# Altium schematic sheet Seven-Seg Displays.SchDoc
size A4; Organization: Machine Intellgence Laboratory; Des1: This board uses a 4-digit; Des2: seven-segment display to show; Des3: battery voltage & current draw.; SheetNumber: 3; SheetTotal: 4; Author1: Russell MacGregor; VersionControl_Repository: BatteryMonitorSpring2025
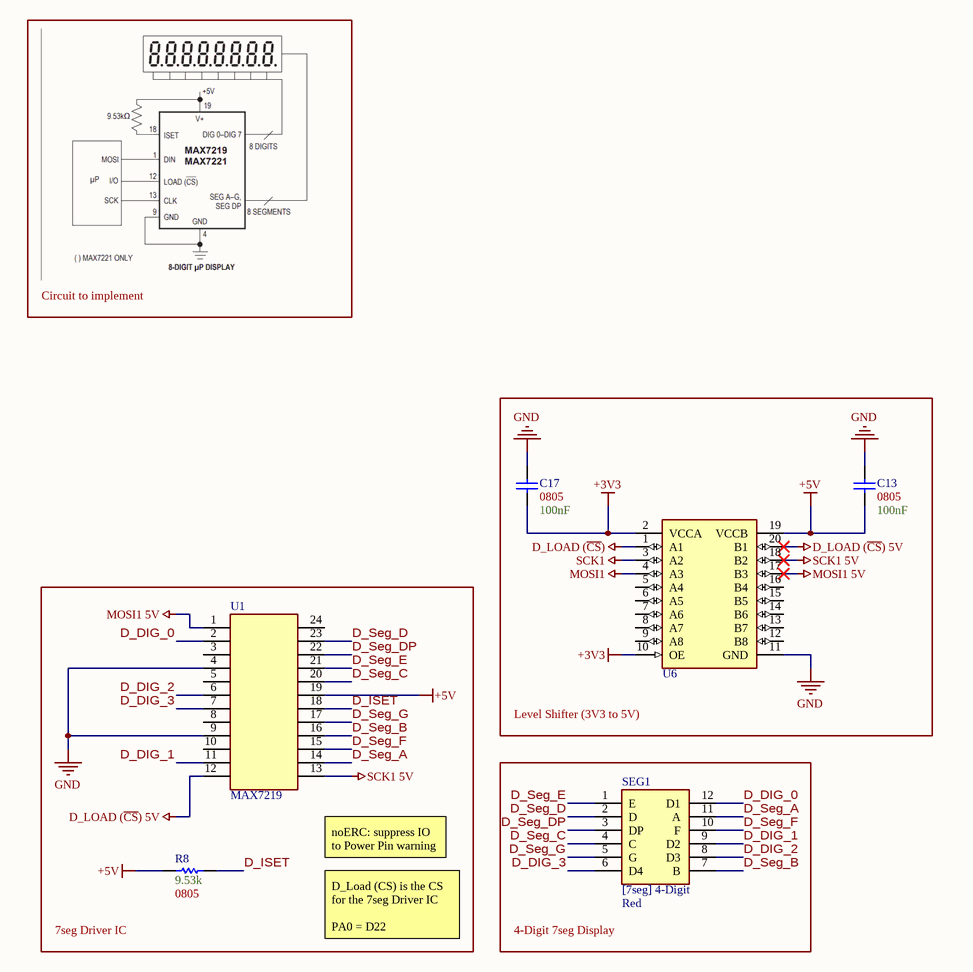
[diagram p0: Seven-Seg Displays.SchDoc]

## Parts
C13  Size Package: 0805  Capacitance: 100nF  [[Cap] SMD 0805]  (hidden comment: [Cap] SMD Nonpolarized)
C17  Size Package: 0805  Capacitance: 100nF  [[Cap] SMD 0805]  (hidden comment: [Cap] SMD Nonpolarized)
R8  Resistance: 9.53k  Size Package: 0805  [[Res] SMD 0805]  (hidden comment: [Res] SMD Resistor)
SEG1  [7seg] 4-Digit  Color: Red  [[7seg] 4-Digit]
U1  MAX7219  [[DIP IC] 24pin, Socket]
U6  [IC] Level Shifter (2)  [[IC] Level Shifter (2)]  (value not drawn)

## Blocks framed on the sheet
Level Shifter (3V3 to 5V): C13 C17 U6
7seg Driver IC: R8 U1
4-Digit 7seg Display: SEG1

## Nets
+3V3: C17.1 U6.2(VCCA) U6.10(OE)
+5V: C13.1 R8.1 U1.19 U6.19(VCCB)
D_LOAD (~{CS}): U6.1(A1)
D_LOAD (~{CS}) 5V: U1.12 U6.20(B1)
GND: C13.2 C17.2 U1.4 U1.9 U6.11(GND)
MOSI1: U6.4(A3)
MOSI1 5V: U1.1 U6.17(B3)
SCK1: U6.3(A2)
SCK1 5V: U1.13 U6.18(B2)
D_DIG_0: SEG1.12(D1) U1.2
D_DIG_1: SEG1.9(D2) U1.11
D_DIG_2: SEG1.8(D3) U1.6
D_DIG_3: SEG1.6(D4) U1.7
D_ISET: R8.2 U1.18
D_Seg_A: SEG1.11(A) U1.14
D_Seg_B: SEG1.7(B) U1.16
D_Seg_C: SEG1.4(C) U1.20
D_Seg_D: SEG1.2(D) U1.23
D_Seg_DP: SEG1.3(DP) U1.22
D_Seg_E: SEG1.1(E) U1.21
D_Seg_F: SEG1.10(F) U1.15
D_Seg_G: SEG1.5(G) U1.17

Not connected (* = marked no-connect by the designer): U1 3 5 8 10 24; U6 5(A4) 6(A5) 7(A6) 8(A7) 9(A8) 12(B8) 13(B7) 14(B6) 15(B5) 16(B4)

## Notes on the sheet
- Circuit to implement
- (near U1) noERC: suppress IO to Power Pin warning
- D_Load (CS) is the CS for the 7seg Driver IC
  PA0 = D22
- Project/Vehicle:
- Author(s):
- -
- Revisor(s):
- Git Repo:
- Git Hash:
- Date:
- Revision:
- Size:
- A4
- File:
- Sheet
- of

## Library data of the parts
U1 = [DIP IC] 24pin: Mouser Part #: *
U6 = [IC] Level Shifter (2): TXS0108EQPWRQ1; Supplier 1: DigiKey; Supplier Part Number 1: 296-42401-1-ND
C13 C17 = [Cap] SMD Nonpolarized: JLC Part #: *; Mouser Part #: *
SEG1 = [7seg] 4-Digit: Mouser Part #: 474-COM-11405